# EAGLE design OpenLog (EAGLE 7.1.0)
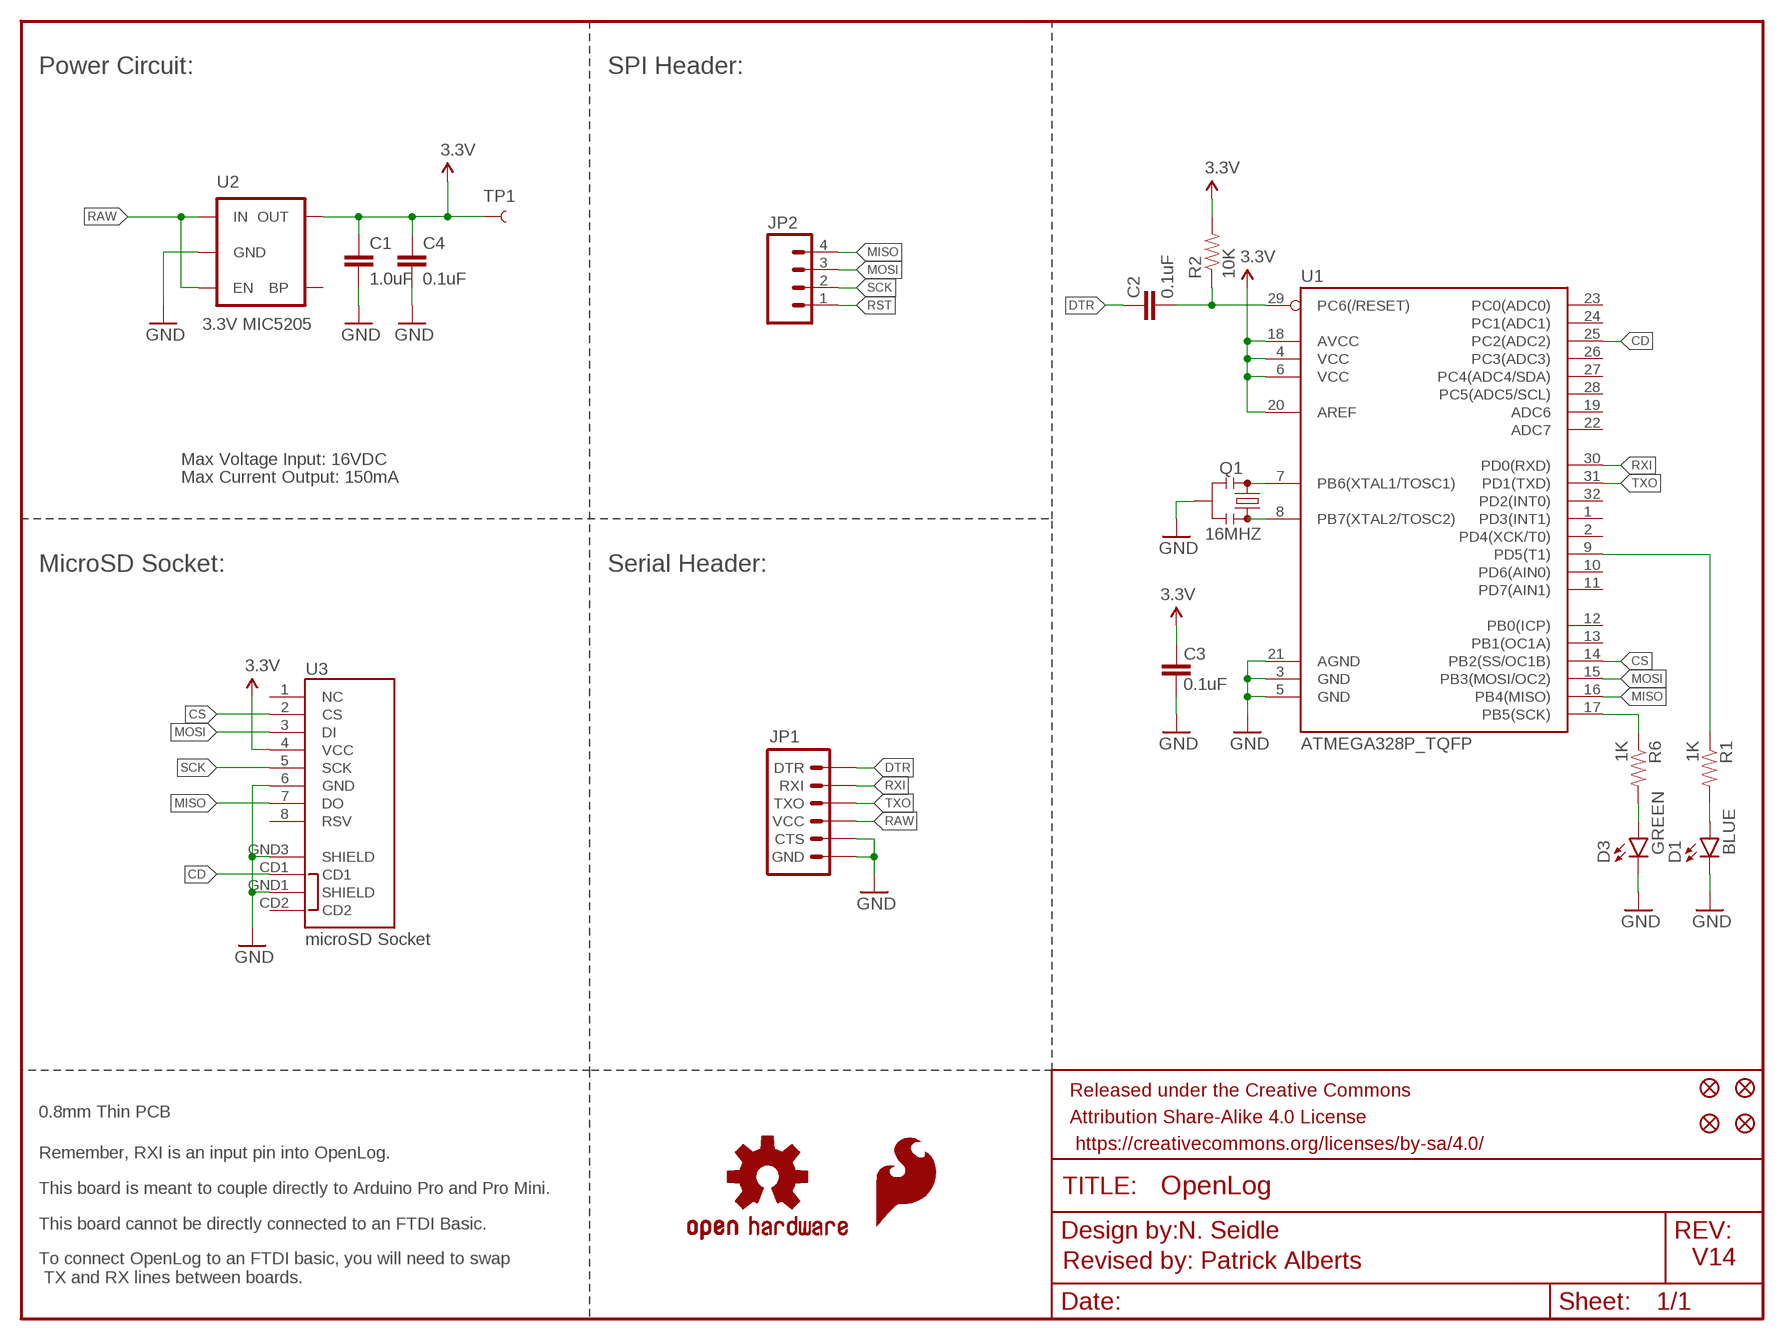
[diagram p0: schematic, sheet 1]

## Parts
C1  1.0uF  1.0UF-16V-10%(0603)  [0603-CAP]
C2  0.1uF  0.1UF-25V(+80/-20%)(0603)  [0603-CAP]
C3  0.1uF  0.1UF-25V(+80/-20%)(0603)  [0603-CAP]
C4  0.1uF  0.1UF-25V(+80/-20%)(0603)  [0603-CAP]
D1  BLUE  LED-BLUE0603  [LED-0603]
D3  GREEN  LED-GREEN0603  [LED-0603]
FID1  FIDUCIALUFIDUCIAL  [MICRO-FIDUCIAL]
FID2  FIDUCIALUFIDUCIAL  [MICRO-FIDUCIAL]
FID3  FIDUCIALUFIDUCIAL  [MICRO-FIDUCIAL]
FID4  FIDUCIALUFIDUCIAL  [MICRO-FIDUCIAL]
FRAME1  FRAME-LETTER  [CREATIVE_COMMONS]
JP1  Serial Connection  ARDUINO_SERIAL_PROGRAMPTH  [1X06]
JP2  M04PTH  [1X04]
LOGO1  SFE_LOGO_FLAME.1_INCH  [SFE_LOGO_FLAME_.1]
LOGO2  OSHW-LOGOS  [OSHW-LOGO-S]
Q1  16MHZ  RESONATOR16MHZ  [RESONATOR-SMD]
R1  1K  1KOHM-1/10W-1%(0603)  [0603-RES]
R2  10K  10KOHM-1/10W-1%(0603)0603  [0603-RES]
R6  1K  1KOHM-1/10W-1%(0603)  [0603-RES]
TP1  TEST-POINT3  [PAD.03X.03]
U1  ATMEGA328P_TQFP  [TQFP32-08]
U2  3.3V MIC5205  MIC52053.3V  [SOT23-5]
U3  microSD Socket  USD-SOCKET  [MICROSD_1:1]

## Nets
3.3V: C1.1 C3.2 C4.1 R2.2 TP1.P$1 U1.4(VCC) U1.6(VCC) U1.18(AVCC) U1.20(AREF) U2.5(OUT) U3.4(VCC)
CD: U1.25(PC2(ADC2)) U3.CD1
CS: U1.14(PB2(SS/OC1B)) U3.2(CS)
DTR: C2.2 JP1.1(DTR)
GND [vcc]: C1.2 C3.1 C4.2 D1.C D3.C JP1.5(CTS) JP1.6(GND) Q1.2 U1.3(GND) U1.5(GND) U1.21(AGND) U2.2(GND) U3.6(GND) U3.GND1(SHIELD) U3.GND3(SHIELD)
MISO: JP2.4 U1.16(PB4(MISO)) U3.7(DO)
MOSI: JP2.3 U1.15(PB3(MOSI/OC2)) U3.3(DI)
N$1: Q1.1 U1.8(PB7(XTAL2/TOSC2))
N$2: Q1.3 U1.7(PB6(XTAL1/TOSC1))
N$3: D1.A R1.2
N$4: R1.1 U1.9(PD5(T1))
N$7: D3.A R6.2
RAW [vcc]: JP1.4(VCC) U2.1(IN) U2.3(EN)
RST: C2.1 JP2.1 R2.1 U1.29(PC6(/RESET))
RXI: JP1.2(RXI) U1.30(PD0(RXD))
SCK: JP2.2 R6.1 U1.17(PB5(SCK)) U3.5(SCK)
TXO: JP1.3(TXO) U1.31(PD1(TXD))
Unconnected: U1.1(PD3(INT1)) U1.2(PD4(XCK/T0)) U1.10(PD6(AIN0)) U1.11(PD7(AIN1)) U1.12(PB0(ICP)) U1.13(PB1(OC1A)) U1.19(ADC6) U1.22(ADC7) U1.23(PC0(ADC0)) U1.24(PC1(ADC1)) U1.26(PC3(ADC3)) U1.27(PC4(ADC4/SDA)) U1.28(PC5(ADC5/SCL)) U1.32(PD2(INT0)) U2.4(BP) U3.1(NC) U3.8(RSV) U3.CD2

## Notes on the sheet
- Power Circuit: | SPI Header:
- Max Voltage Input: 16VDC
- Max Current Output: 150mA
- MicroSD Socket: | Serial Header:
- 0.8mm Thin PCB
- Remember, RXI is an input pin into OpenLog.
- This board is meant to couple directly to Arduino Pro and Pro Mini.
- This board cannot be directly connected to an FTDI Basic.
- N. Seidle
- Revised by: Patrick Alberts | V14
- To connect OpenLog to an FTDI basic, you will need to swap
   TX and RX lines between boards.

## Library data of the parts
C1 = SparkFun-Capacitors:1.0UF-16V-10%(0603): CAP-00868; PROD_ID: CAP-00868
C2-C4 = SparkFun-Capacitors:0.1UF-25V(+80/-20%)(0603): CAP-00810 Ceramic Standard decoupling cap; PROD_ID: CAP-00810
D1 = SparkFun-LED:LED-BLUE: Blue LEDs for production use Various blue LEDs stocked by SparkFun production 0603 - DIO-08575 Rebel - DIO-09553 1206 - DIO-09911; PROD_ID: DIO-08575
D3 = SparkFun-LED:LED-GREEN: Various green LEDs Green LEDs used in SFE Production 0603- DIO-00821 LARGE- DIO-00862 LILYPAD- DIO-09910; PROD_ID: DIO-00821
FID1-FID4 = SparkFun-Aesthetics:FIDUCIAL: Fiducial Alignment Points Various fiducial points for machine vision alignment.
FRAME1 = SparkFun-Aesthetics:FRAME-LETTER: Schematic Frame Standard 8.5x11 US Letter frame; DESIGNER: NAME; VERSION: v01
JP1 = SparkFun:ARDUINO_SERIAL_PROGRAM
JP2 = SparkFun:M04: Header 4 Standard 4-pin 0.1" header. Use with straight break away headers (SKU : PRT-00116), right angle break away headers (PRT-00553), swiss pins (PRT-00743), machine pins (PRT-00117), and female headers (PRT-00115). Molex polarized connector foot print use with SKU : PRT-08231 with associated crimp pins and housings.
LOGO1 = SparkFun-Aesthetics:SFE_LOGO_FLAME: SFE Logo, flame only This is the SparkFun flame logo. The logo on the schematic will always be the same size; the package variant is the height of the flame. Default layer for the logo on the board is tSilk.
LOGO2 = SparkFun-Aesthetics:OSHW-LOGO: Open Source Hardware Logo This logo indicates the piece of hardware it is found on incorporates a OSHW license and/or adheres to the definition of open source hardware found here: http://freedomdefined.org/OSHW
Q1 = SparkFun-FreqCtrl:RESONATOR: Resonator Small SMD resonator. Used, eg, on the Arduino Pro/ Pro Mini boards. 8MHz- XTAL-08895 16MHz- XTAL-08900; PROD_ID: XTAL-08900
R1 R6 = SparkFun-Resistors:1KOHM-1/10W-1%(0603): RES-07856; PROD_ID: RES-07856
R2 = SparkFun-Resistors:10KOHM-1/10W-1%(0603): RES-00824; PROD_ID: RES-00824
TP1 = SparkFun-Passives:TEST-POINT: Bare copper test points for troubleshooting or ICT
U1 = SparkFun-DigitalIC:ATMEGA328P_TQFP; PROD_ID: IC-09069
U2 = SparkFun-PowerIC:MIC5205: MIC5205 150mA vreg 3.3V - VREG-00822 5V - VREG-00823; PROD_ID: VREG-00822
U3 = SparkFun-Connectors:USD-SOCKET: microSD Socket Push-push type uSD socket. Schematic element and footprint production proven. Spark Fun Electronics SKU : PRT-00127. tDoc lines correctly indicate media card edge positions when inserting (unlocked, locked, depressed). NOTE: CD1 and CD2 are connected internally; PROD_ID: CONN-07820

## Net classes
0 default: width 0.178 mm
1 vcc: width 0.203 mm

## Board
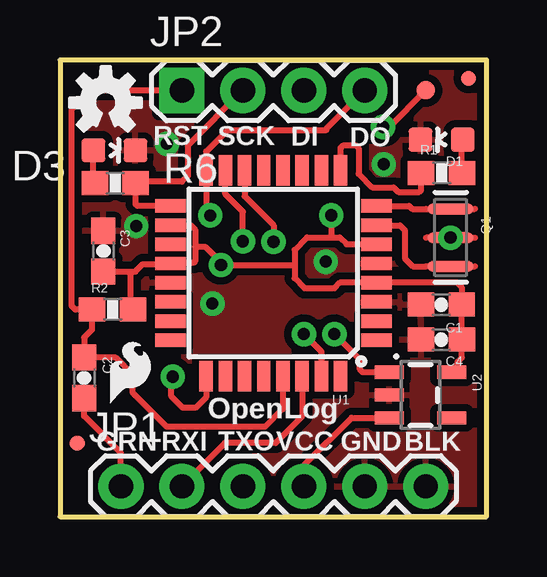
[diagram p1: board, top side]
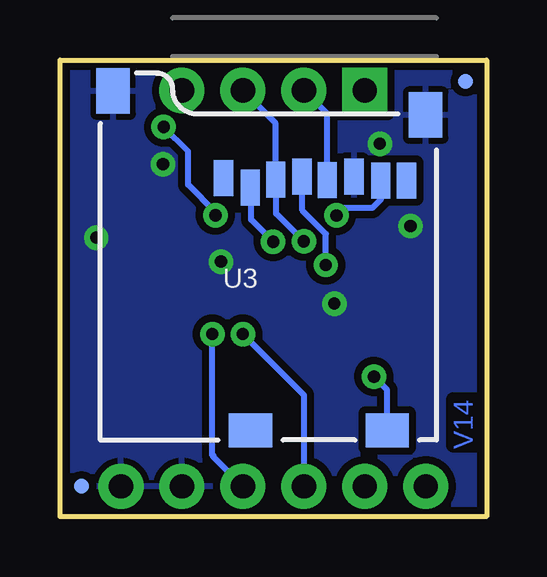
[diagram p2: board, bottom side, seen from below]

Size 17.78 x 19.05 mm. Coordinates in mm from the lower left corner, seen from the top.
Outline: 17.78,0 17.78,19.05 0,19.05 0,0 17.78,0
Copper layers (1*16): Top 0.035mm / dielectric 1.5mm / Bottom 0.035mm
Design rules "SparkFun-2-layer": minimum track width 7mil, minimum drill 15mil, track to track 8mil, track to pad 8mil, pad to pad 8mil, via to via 8mil, smd to smd 8mil, copper to edge 8mil, drill to drill 8mil, minimum pad ring 12mil, minimum via ring 10mil, stop-mask expansion 4mil, vias tented up to drill 20mil, thermal gap 10mil

### Footprints (pad centres in the part's own frame; a part is rotated, then mirrored left to right if it is on the bottom)
0603-CAP = smd 1.1 x 1: 1 -0.85,0; 2 0.85,0
LED-0603 = smd 1 x 1: A 0,-0.877; C 0,0.877
MICRO-FIDUCIAL = smd 0.635 x 0.635: 1 0,0
1X06 = drill 1.016 pad 1.88: 1 0,0; 2 2.54,0; 3 5.08,0; 4 7.62,0; 5 10.16,0; 6 12.7,0
1X04 = drill 1.016 pad 1.88 square: 1 0,0 | drill 1.016 pad 1.88: 2 2.54,0; 3 5.08,0; 4 7.62,0
RESONATOR-SMD = smd 0.45 x 1.905: 1 -1.2,0; 2 0,0; 3 1.2,0
0603-RES = smd 1.1 x 1: 1 -0.85,0; 2 0.85,0
PAD.03X.03 = smd 0.762 x 0.762: P$1 0,0
TQFP32-08 = smd 1.27 x 0.559: 1 -4.293,2.8; 2 -4.293,2; 3 -4.293,1.2; 4 -4.293,0.4; 5 -4.293,-0.4; 6 -4.293,-1.2; 7 -4.293,-2; 8 -4.293,-2.8; 17 4.293,-2.8; 18 4.293,-2; 19 4.293,-1.2; 20 4.293,-0.4; 21 4.293,0.4; 22 4.293,1.2; 23 4.293,2; 24 4.293,2.8 | smd 0.559 x 1.27: 9 -2.8,-4.293; 10 -2,-4.293; 11 -1.2,-4.293; 12 -0.4,-4.293; 13 0.4,-4.293; 14 1.2,-4.293; 15 2,-4.293; 16 2.8,-4.293; 25 2.8,4.293; 26 2,4.293; 27 1.2,4.293; 28 0.4,4.293; 29 -0.4,4.293; 30 -1.2,4.293; 31 -2,4.293; 32 -2.8,4.293
SOT23-5 = smd 0.55 x 1.2: 1 -0.95,-1.3; 2 0,-1.3; 3 0.95,-1.3; 4 0.95,1.3; 5 -0.95,1.3
MICROSD_1:1 = smd 0.8 x 1.5: 1 5.096,10.919; 2 6.218,10.519; 3 7.274,10.853; 4 8.367,10.982; 5 9.421,10.828; 6 10.539,10.973; 7 11.648,10.819; 8 12.721,10.819 | smd 1.8 x 1.4: CD1 11.92,0.4; CD2 6.22,0.4 | smd 1.4 x 1.9: GND1 0.497,14.55; GND3 13.52,13.55

### Placement (x,y rotation side)
C1  15.89,8.85 180 top
C2  1.01,5.79 270 top
C3  1.81,11.08 270 top
C4  15.89,7.38 180 top
D1  15.9,15.72 90 top
D3  2.27,15.28 270 top
FID1  17.02,18.29 0 top
FID2  0.72,3.07 0 top
FID3  16.89,1.27 0 bottom
FID4  0.89,18.16 0 bottom
FRAME1  -19.79,-15.24 0 top  (outside the outline)
JP1  2.54,1.27 0 top
JP2  5.08,17.78 0 top
LOGO1  1.77,4.38 0 top
LOGO2  1.9,17.27 0 top
Q1  16.27,11.64 270 top
R1  15.9,14.34 0 top
R2  2.19,8.64 0 top
R6  2.3,13.92 180 top
TP1  15.24,17.78 0 top
U1  8.89,10.16 180 top
U2  15.02,5.08 270 top
U3  16.07,3.2 0 bottom

### Tracks (layer width: path | path; a pad name or v marks a point on that pad's centre or on a via)
3.3V  (via drill 0.51)
  Top 0.254: U1.4 12.43,9.76 11.66,9.76 11.43,9.53 10.19,9.53 9.77,9.95 9.77,10.5 | C3.2 2.95,10.23 | 2.95,10.23 3.14,10.23 3.45,10.54 4.57,10.54 U1.20 | R2.2 arc-90 2.95,8.73 2.95,10.23 | U1.4 | U1.18 4.61,12.14 5.47,12.14 5.63,11.99 5.63,11.26 | U2.5 16.57,6.03 16.57,6.46 16.75,6.64 C4.1 C1.1 16.74,9.58 16.53,9.78 13.21,9.78 | 11.3,11.65 10.29,11.65 9.77,11.13 9.77,10.5 | 11.3,11.65 11.65,11.65 11.94,11.36 U1.6 | 9.77,10.5 v6.71,10.5 6.71,10.62 6.08,11.24 5.65,11.24 5.63,11.26 | U1.20 | 5.63,11.26 5.63,10.65 5.56,10.58 4.62,10.58 U1.20 | U1.4 13.21,9.78 | 13.21,9.78 | v11.3,12.57 11.3,11.65 | 15.11,17.91 TP1.P$1 13.72,16.26 v13.46,16.26
  Bottom 0.254: v6.71,10.5 6.71,11.79 7.69,12.77 7.69,14.17 U3.4 | v11.3,12.57 11.3,12.7 12.45,13.84 12.45,15.24 v13.46,16.26
CD  (via drill 0.51)
  Top 0.203: v4.7,5.84 4.72,5.87
  Top 0.254: U1.25 6.09,4.98 5.65,4.54 5.11,4.54 4.64,5.02 4.64,5.78 v4.7,5.84
  Bottom 0.254: U3.CD1 4.14,5.29 v4.7,5.84
CS  (via drill 0.51)
  Top 0.254: U1.14 7.69,13.37 8.9,12.16 v8.9,11.47
  Bottom 0.254: v8.9,11.47 9.82,12.39 9.82,13.69 U3.2
DTR
  Top 0.254: JP1.1 2.54,2.66 1,4.2 C2.2
GND  (via drill 0.51)
  other vias: 6.35,8.89 16.27,11.64 11.07,10.64 3.18,12.12 4.45,15.55 13.49,14.7
  pour Top (isolate 0.305): 17.78,0 0,0 0,19.05 17.78,19.05
  pour Bottom (isolate 0.305): 17.78,0 0,0 0,19.05 17.78,19.05
MISO  (via drill 0.51)
  Top 0.254: v6.26,12.56 6.09,12.74 U1.16 6.09,15.23 6.98,16.13 11.1,16.13 11.1,16.18 JP2.4
  Bottom 0.254: v6.26,12.56 5.94,12.88 4.77,12.88 4.4,13.25 4.4,14.01 U3.7
MOSI  (via drill 0.51)
  Top 0.254: v7.62,11.49 7.62,12.72 6.89,13.45 U1.15
  Bottom 0.254: v7.62,11.49 8.77,12.64 8.77,14.04 U3.3 8.79,16.41 JP2.3
N$1
  Top 0.254: U1.8 14.55,12.96 14.67,12.84 Q1.1
N$2
  Top 0.254: U1.7 14.17,12.15 14.37,11.96 14.37,10.78 14.7,10.44 15.25,10.44
N$3
  Top 0.254: R1.2 16.75,15.69 D1.A
N$4
  Top 0.254: U1.9 11.69,15.37 11.81,15.49 12.32,15.49 12.45,15.37 12.45,14.3 13.02,13.73 13.9,13.73 14.09,13.54 14.97,13.54 15.05,13.62 R1.1
N$7
  Top 0.254: R6.2 1.39,13.98 D3.A
RAW  (via drill 0.51)
  Top 0.254: 13.71,4.14 U2.3 12.15,4.13 10.18,2.16 10.18,1.29 JP1.4 | U2.1 12.61,6.03 12.49,6.15 12.49,6.56 v11.43,7.62
  Bottom 0.254: v11.43,7.62 11.43,2.54 11.39,2.54 11.39,2.5 JP1.4
RST
  Top 0.254: U1.29 9.29,4.49 8.54,3.75 4.45,3.75 3.04,5.16 3.04,5.92 2.31,6.64 C2.1 1,7.47 1.34,7.8 R2.1 0.64,8.64 0.49,8.8 0.49,17 1.27,17.78 JP2.1
RXI
  Top 0.254: U1.30 10.09,4.18 8.99,3.08 6.85,3.08 6.85,3.04 JP1.2
SCK
  Top 0.254: R6.1 | U1.17 3.23,12.96 3.15,13.04 R6.1 | R6.1 | R6.1 3.2,13.97 5.08,13.97 5.33,14.22 5.33,15.49 JP2.2
  Bottom 0.254: U3.5 6.64,16.8 JP2.2
TXO  (via drill 0.51)
  Top 0.254: v10.16,7.62 10.89,6.89 U1.31
  Bottom 0.254: v10.16,7.62 7.62,5.08 JP1.3

### Text on the board
Bottom: V14
tPlace: RST | SCK | DI | DO | OpenLog | GRN | RXI | TXO | VCC | GND | BLK
tDocu: 0.8mm Thin PCB | N. Seidle | Revised by: Patrick Alberts